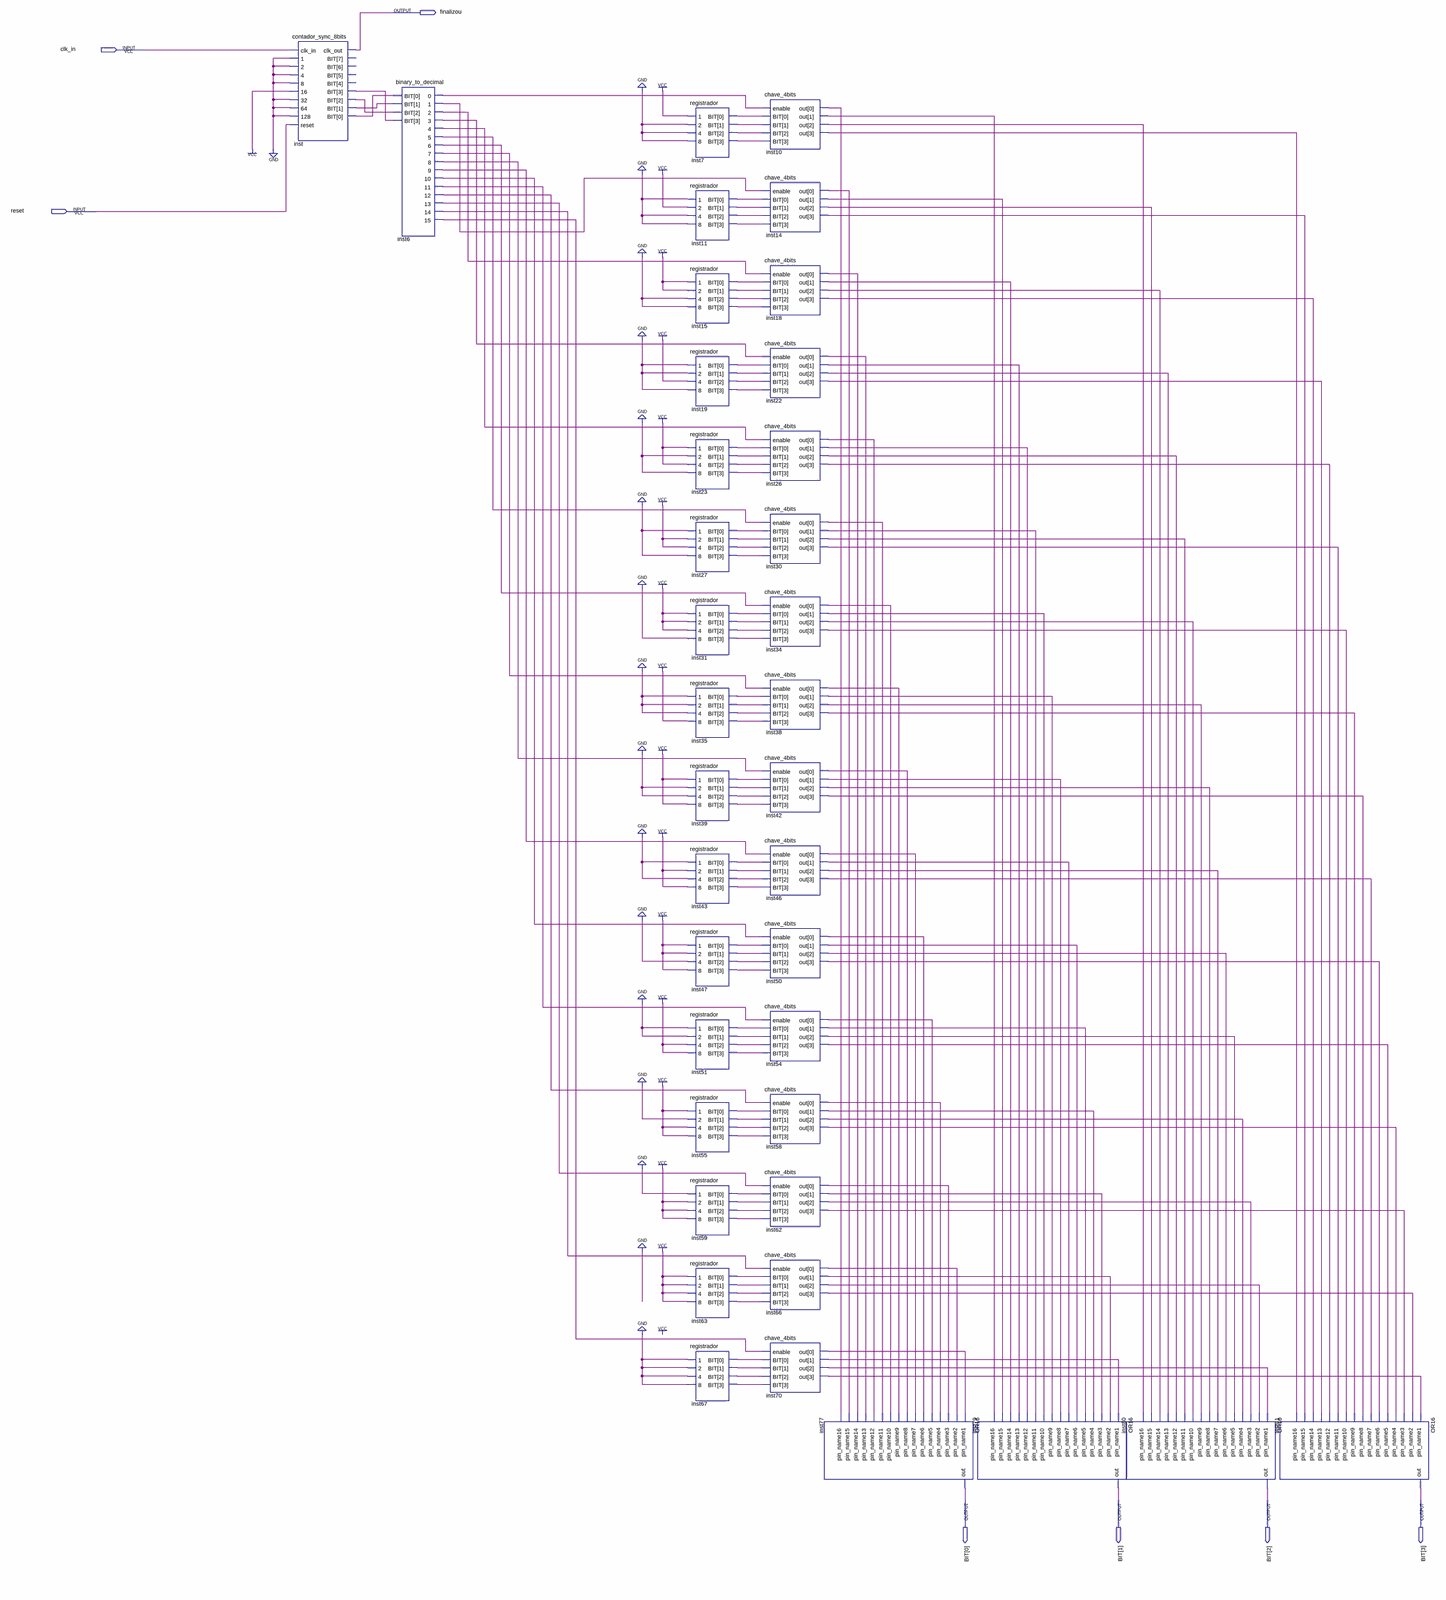
[diagram p0: schematic sheet, whole]
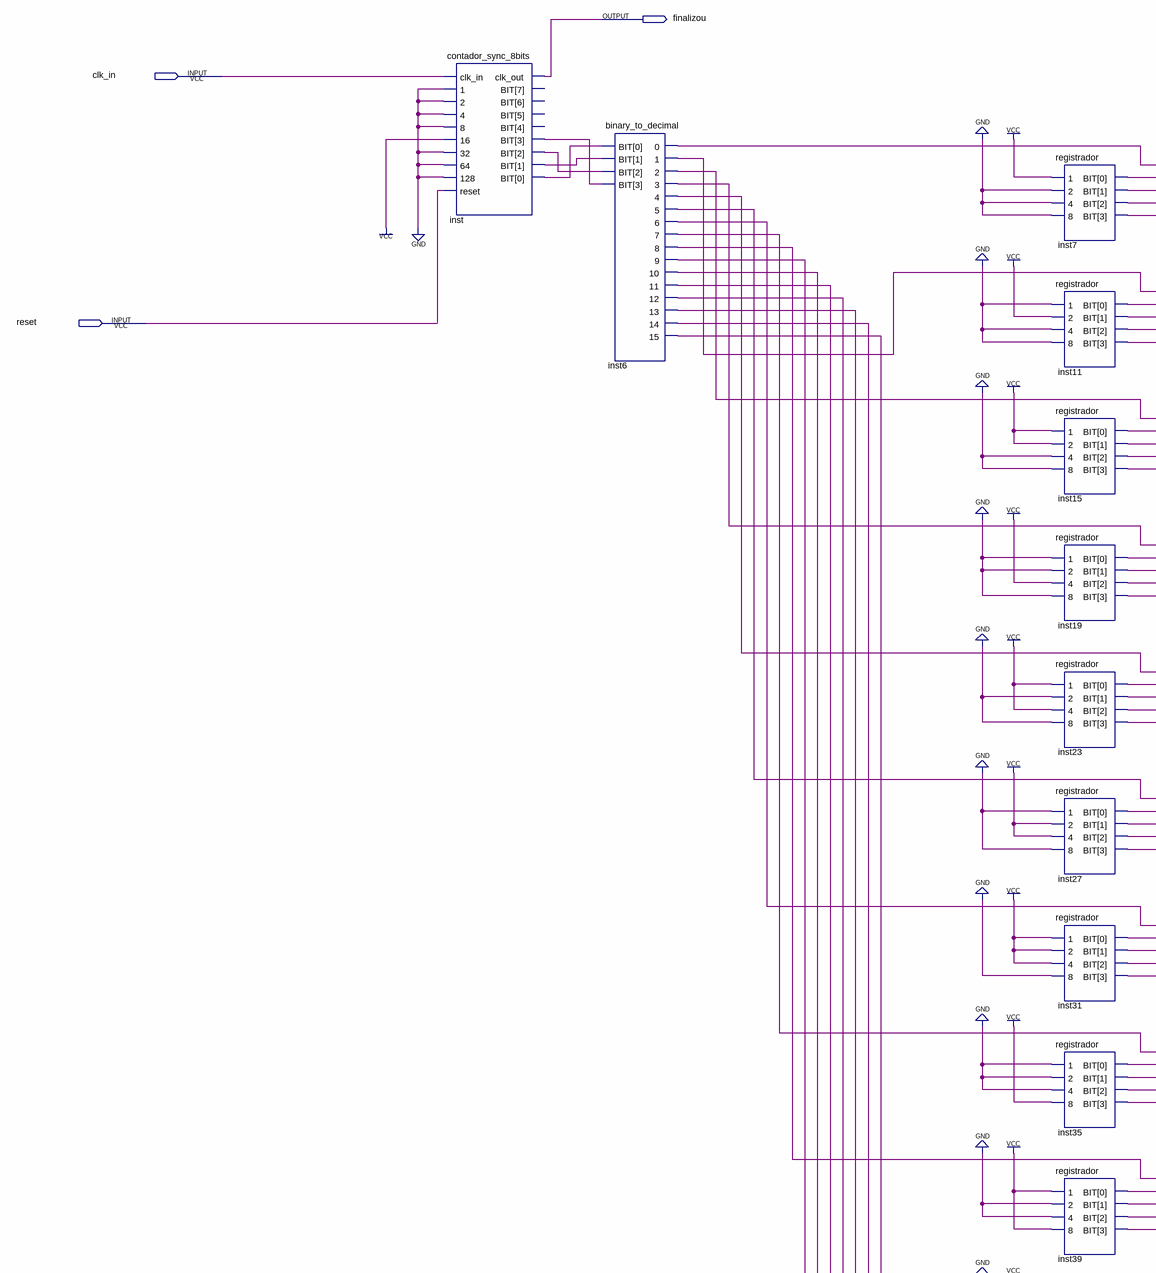
[diagram p1: schematic sheet, upper left part]
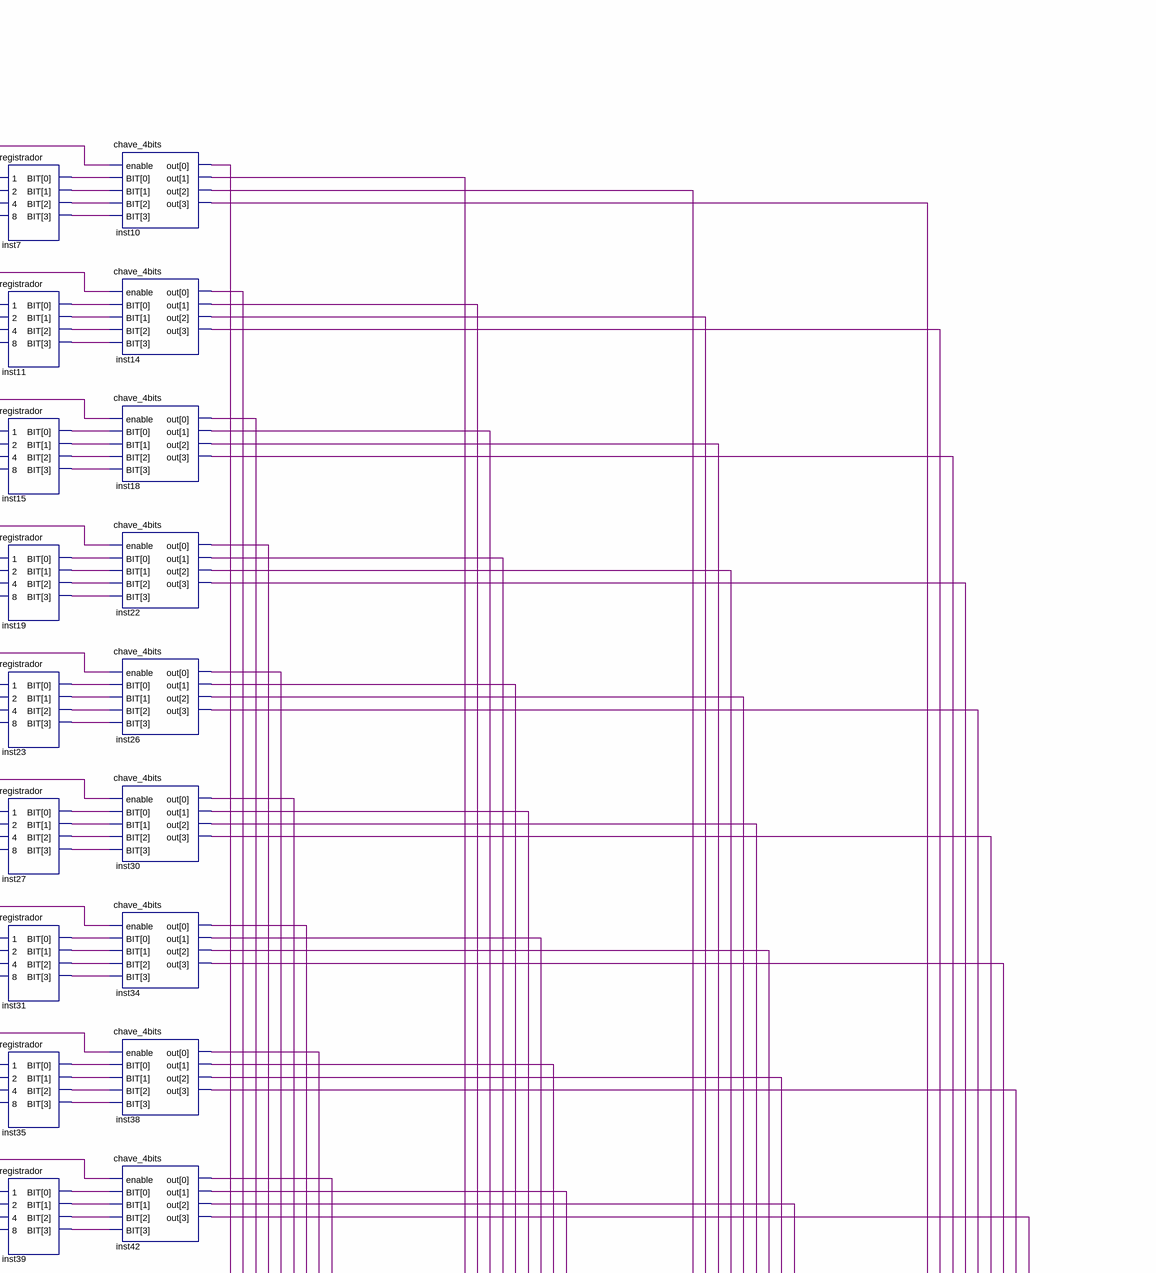
[diagram p2: schematic sheet, upper right part]
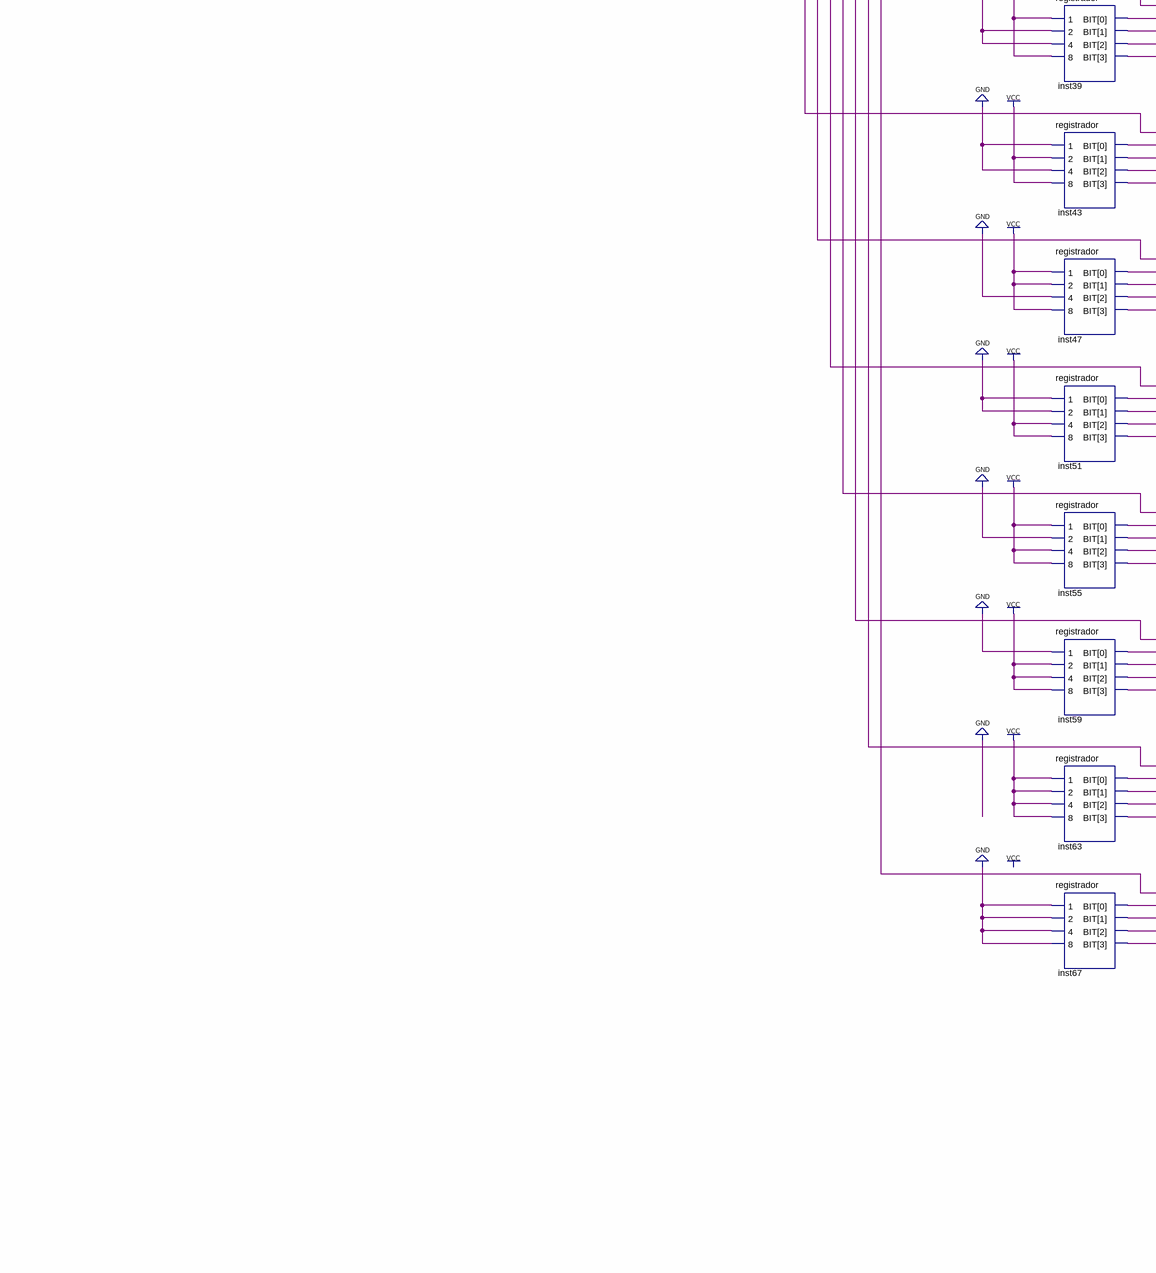
[diagram p3: schematic sheet, lower left part]
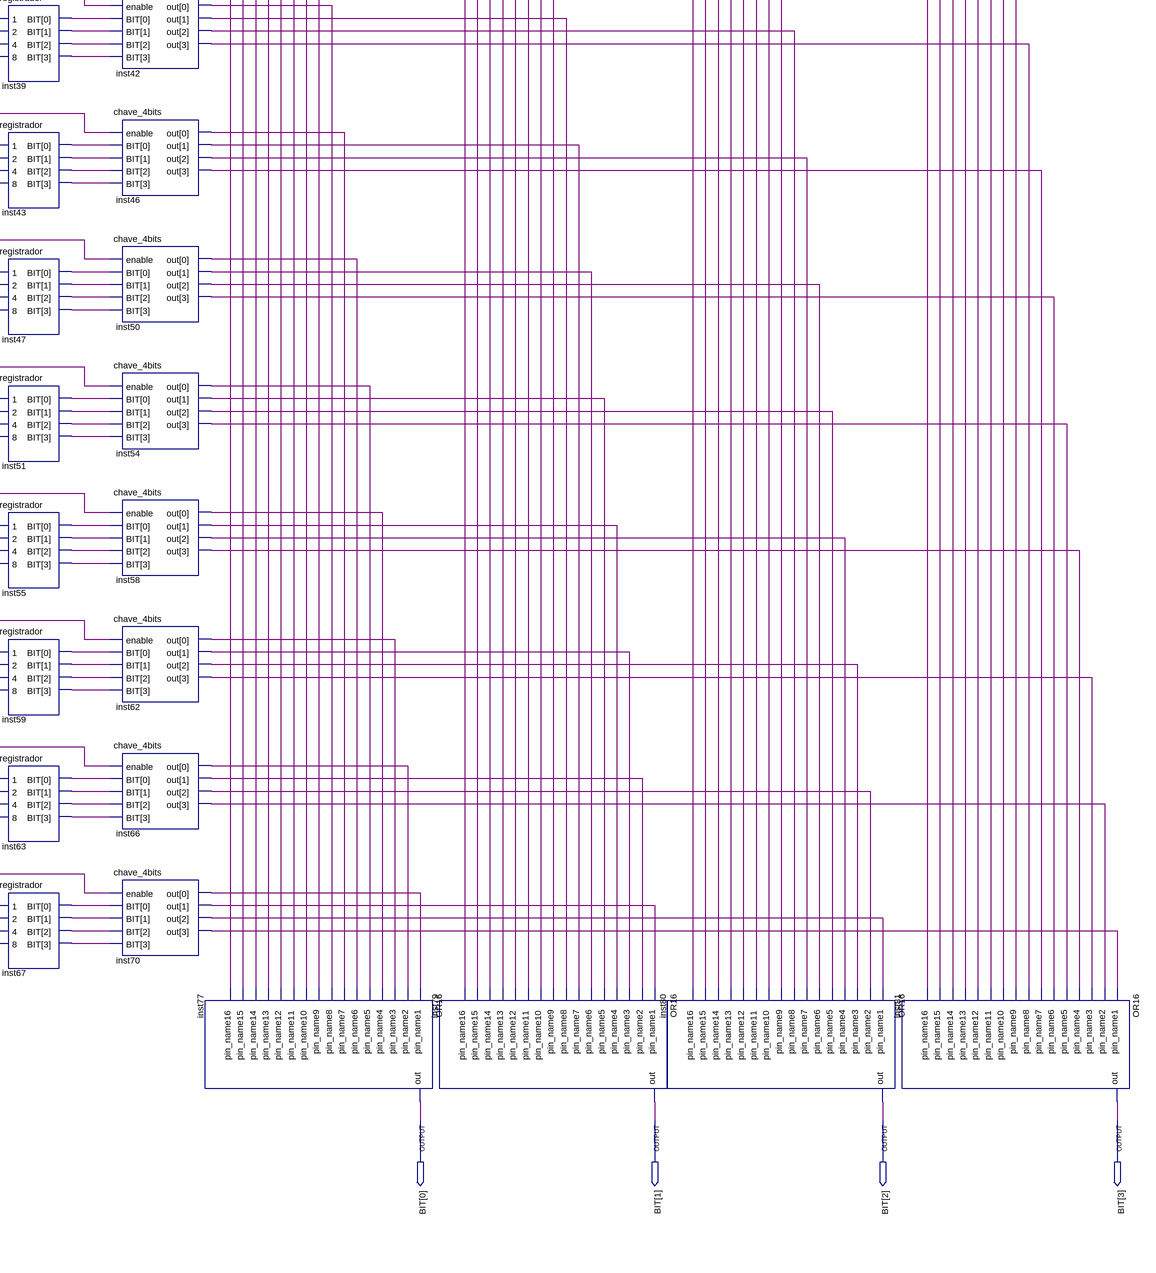
[diagram p4: schematic sheet, lower right part]
// Quartus schematic banco_de_registradores.bdf as structural Verilog: 38 symbols, 7 pins
module banco_de_registradores (
  input  clk_in,
  input  reset,
  output finalizou,
  output [3:0] BIT
);

  wire inst6_0, inst6_1, inst6_2, inst6_3, inst6_4, inst6_5, inst6_6, inst6_7, inst6_8, inst6_9, inst6_10,
       inst6_11, inst6_12, inst6_13, inst6_14, inst6_15, inst7_bit, inst7_bit_2, inst7_bit_3, inst7_bit_4,
       inst10_out, inst10_out_2, inst10_out_3, inst10_out_4, inst11_bit, inst11_bit_2, inst11_bit_3,
       inst11_bit_4, inst14_out, inst14_out_2, inst14_out_3, inst14_out_4, inst15_bit, inst15_bit_2,
       inst15_bit_3, inst15_bit_4, inst18_out, inst18_out_2, inst18_out_3, inst18_out_4, inst19_bit,
       inst19_bit_2, inst19_bit_3, inst19_bit_4, inst22_out, inst22_out_2, inst22_out_3, inst22_out_4,
       inst23_bit, inst23_bit_2, inst23_bit_3, inst23_bit_4, inst26_out, inst26_out_2, inst26_out_3,
       inst26_out_4, inst27_bit, inst27_bit_2, inst27_bit_3, inst27_bit_4, inst30_out, inst30_out_2,
       inst30_out_3, inst30_out_4, inst31_bit, inst31_bit_2, inst31_bit_3, inst31_bit_4, inst34_out,
       inst34_out_2, inst34_out_3, inst34_out_4, inst35_bit, inst35_bit_2, inst35_bit_3, inst35_bit_4,
       inst38_out, inst38_out_2, inst38_out_3, inst38_out_4, inst39_bit, inst39_bit_2, inst39_bit_3,
       inst39_bit_4, inst42_out, inst42_out_2, inst42_out_3, inst42_out_4, inst43_bit, inst43_bit_2,
       inst43_bit_3, inst43_bit_4, inst46_out, inst46_out_2, inst46_out_3, inst46_out_4, inst47_bit,
       inst47_bit_2, inst47_bit_3, inst47_bit_4, inst50_out, inst50_out_2, inst50_out_3, inst50_out_4,
       inst51_bit, inst51_bit_2, inst51_bit_3, inst51_bit_4, inst54_out, inst54_out_2, inst54_out_3,
       inst54_out_4, inst55_bit, inst55_bit_2, inst55_bit_3, inst55_bit_4, inst58_out, inst58_out_2,
       inst58_out_3, inst58_out_4, inst59_bit, inst59_bit_2, inst59_bit_3, inst59_bit_4, inst62_out,
       inst62_out_2, inst62_out_3, inst62_out_4, inst63_bit, inst63_bit_2, inst63_bit_3, inst63_bit_4,
       inst66_out, inst66_out_2, inst66_out_3, inst66_out_4, inst67_bit, inst67_bit_2, inst67_bit_3,
       inst67_bit_4, inst70_out, inst70_out_2, inst70_out_3, inst70_out_4, inst_bit, inst_bit_2, inst_bit_3,
       inst_bit_4;
  wire [7:0] inst_bit_open;  // unused outputs

  contador_sync_8bits inst (
    .clk_in(clk_in), .\1 (1'b0), .\2 (1'b0), .\4 (1'b0), .\8 (1'b0), .\16 (1'b1), .\32 (1'b0), .\64 (1'b0),
    .\128 (1'b0), .reset(reset), .clk_out(finalizou),
    .BIT({inst_bit_open[7:4], inst_bit_4, inst_bit_3, inst_bit_2, inst_bit}));
  binary_to_decimal inst6 (
    .BIT({inst_bit_4, inst_bit_3, inst_bit_2, inst_bit}), .\0 (inst6_0), .\1 (inst6_1), .\2 (inst6_2),
    .\3 (inst6_3), .\4 (inst6_4), .\5 (inst6_5), .\6 (inst6_6), .\7 (inst6_7), .\8 (inst6_8), .\9 (inst6_9),
    .\10 (inst6_10), .\11 (inst6_11), .\12 (inst6_12), .\13 (inst6_13), .\14 (inst6_14), .\15 (inst6_15));
  registrador inst7 (
    .\1 (1'b1), .\2 (1'b0), .\4 (1'b0), .\8 (1'b0), .BIT({inst7_bit_4, inst7_bit_3, inst7_bit_2, inst7_bit}));
  registrador inst11 (
    .\1 (1'b0), .\2 (1'b1), .\4 (1'b0), .\8 (1'b0),
    .BIT({inst11_bit_4, inst11_bit_3, inst11_bit_2, inst11_bit}));
  registrador inst15 (
    .\1 (1'b1), .\2 (1'b1), .\4 (1'b0), .\8 (1'b0),
    .BIT({inst15_bit_4, inst15_bit_3, inst15_bit_2, inst15_bit}));
  registrador inst19 (
    .\1 (1'b0), .\2 (1'b0), .\4 (1'b1), .\8 (1'b0),
    .BIT({inst19_bit_4, inst19_bit_3, inst19_bit_2, inst19_bit}));
  registrador inst23 (
    .\1 (1'b1), .\2 (1'b0), .\4 (1'b1), .\8 (1'b0),
    .BIT({inst23_bit_4, inst23_bit_3, inst23_bit_2, inst23_bit}));
  registrador inst27 (
    .\1 (1'b0), .\2 (1'b1), .\4 (1'b1), .\8 (1'b0),
    .BIT({inst27_bit_4, inst27_bit_3, inst27_bit_2, inst27_bit}));
  registrador inst31 (
    .\1 (1'b1), .\2 (1'b1), .\4 (1'b1), .\8 (1'b0),
    .BIT({inst31_bit_4, inst31_bit_3, inst31_bit_2, inst31_bit}));
  registrador inst35 (
    .\1 (1'b0), .\2 (1'b0), .\4 (1'b0), .\8 (1'b1),
    .BIT({inst35_bit_4, inst35_bit_3, inst35_bit_2, inst35_bit}));
  registrador inst39 (
    .\1 (1'b1), .\2 (1'b0), .\4 (1'b0), .\8 (1'b1),
    .BIT({inst39_bit_4, inst39_bit_3, inst39_bit_2, inst39_bit}));
  registrador inst43 (
    .\1 (1'b0), .\2 (1'b1), .\4 (1'b0), .\8 (1'b1),
    .BIT({inst43_bit_4, inst43_bit_3, inst43_bit_2, inst43_bit}));
  registrador inst47 (
    .\1 (1'b1), .\2 (1'b1), .\4 (1'b0), .\8 (1'b1),
    .BIT({inst47_bit_4, inst47_bit_3, inst47_bit_2, inst47_bit}));
  registrador inst51 (
    .\1 (1'b0), .\2 (1'b0), .\4 (1'b1), .\8 (1'b1),
    .BIT({inst51_bit_4, inst51_bit_3, inst51_bit_2, inst51_bit}));
  registrador inst55 (
    .\1 (1'b1), .\2 (1'b0), .\4 (1'b1), .\8 (1'b1),
    .BIT({inst55_bit_4, inst55_bit_3, inst55_bit_2, inst55_bit}));
  registrador inst59 (
    .\1 (1'b0), .\2 (1'b1), .\4 (1'b1), .\8 (1'b1),
    .BIT({inst59_bit_4, inst59_bit_3, inst59_bit_2, inst59_bit}));
  registrador inst63 (
    .\1 (1'b1), .\2 (1'b1), .\4 (1'b1), .\8 (1'b1),
    .BIT({inst63_bit_4, inst63_bit_3, inst63_bit_2, inst63_bit}));
  registrador inst67 (
    .\1 (1'b0), .\2 (1'b0), .\4 (1'b0), .\8 (1'b0),
    .BIT({inst67_bit_4, inst67_bit_3, inst67_bit_2, inst67_bit}));
  chave_4bits inst10 (
    .enable(inst6_0), .BIT({inst7_bit_4, inst7_bit_3, inst7_bit_2, inst7_bit}),
    .out({inst10_out_3, inst10_out_4, inst10_out_2, inst10_out}));
  chave_4bits inst14 (
    .enable(inst6_1), .BIT({inst11_bit_4, inst11_bit_3, inst11_bit_2, inst11_bit}),
    .out({inst14_out_3, inst14_out_4, inst14_out_2, inst14_out}));
  chave_4bits inst18 (
    .enable(inst6_2), .BIT({inst15_bit_4, inst15_bit_3, inst15_bit_2, inst15_bit}),
    .out({inst18_out_4, inst18_out_3, inst18_out_2, inst18_out}));
  chave_4bits inst22 (
    .enable(inst6_3), .BIT({inst19_bit_4, inst19_bit_3, inst19_bit_2, inst19_bit}),
    .out({inst22_out_4, inst22_out_3, inst22_out_2, inst22_out}));
  chave_4bits inst26 (
    .enable(inst6_4), .BIT({inst23_bit_4, inst23_bit_3, inst23_bit_2, inst23_bit}),
    .out({inst26_out_3, inst26_out_2, inst26_out_4, inst26_out}));
  chave_4bits inst30 (
    .enable(inst6_5), .BIT({inst27_bit_4, inst27_bit_3, inst27_bit_2, inst27_bit}),
    .out({inst30_out_4, inst30_out_3, inst30_out_2, inst30_out}));
  chave_4bits inst34 (
    .enable(inst6_6), .BIT({inst31_bit_4, inst31_bit_3, inst31_bit_2, inst31_bit}),
    .out({inst34_out_4, inst34_out_3, inst34_out_2, inst34_out}));
  chave_4bits inst38 (
    .enable(inst6_7), .BIT({inst35_bit_4, inst35_bit_3, inst35_bit_2, inst35_bit}),
    .out({inst38_out_4, inst38_out_3, inst38_out_2, inst38_out}));
  chave_4bits inst42 (
    .enable(inst6_8), .BIT({inst39_bit_4, inst39_bit_3, inst39_bit_2, inst39_bit}),
    .out({inst42_out_4, inst42_out_3, inst42_out_2, inst42_out}));
  chave_4bits inst46 (
    .enable(inst6_9), .BIT({inst43_bit_4, inst43_bit_3, inst43_bit_2, inst43_bit}),
    .out({inst46_out_4, inst46_out_3, inst46_out_2, inst46_out}));
  chave_4bits inst50 (
    .enable(inst6_10), .BIT({inst47_bit_4, inst47_bit_3, inst47_bit_2, inst47_bit}),
    .out({inst50_out_4, inst50_out_3, inst50_out_2, inst50_out}));
  chave_4bits inst54 (
    .enable(inst6_11), .BIT({inst51_bit_4, inst51_bit_3, inst51_bit_2, inst51_bit}),
    .out({inst54_out_4, inst54_out_3, inst54_out_2, inst54_out}));
  chave_4bits inst58 (
    .enable(inst6_12), .BIT({inst55_bit_4, inst55_bit_3, inst55_bit_2, inst55_bit}),
    .out({inst58_out_4, inst58_out_3, inst58_out_2, inst58_out}));
  chave_4bits inst62 (
    .enable(inst6_13), .BIT({inst59_bit_4, inst59_bit_3, inst59_bit_2, inst59_bit}),
    .out({inst62_out_3, inst62_out_2, inst62_out_4, inst62_out}));
  chave_4bits inst66 (
    .enable(inst6_14), .BIT({inst63_bit_4, inst63_bit_3, inst63_bit_2, inst63_bit}),
    .out({inst66_out_3, inst66_out_2, inst66_out_4, inst66_out}));
  chave_4bits inst70 (
    .enable(inst6_15), .BIT({inst67_bit_4, inst67_bit_3, inst67_bit_2, inst67_bit}),
    .out({inst70_out_3, inst70_out_2, inst70_out_4, inst70_out}));
  OR16 inst77 (
    .pin_name1(inst70_out), .pin_name2(inst66_out), .pin_name3(inst62_out), .pin_name4(inst58_out),
    .pin_name5(inst54_out), .pin_name6(inst50_out), .pin_name7(inst46_out), .pin_name8(inst42_out),
    .pin_name9(inst38_out), .pin_name10(inst34_out), .pin_name11(inst30_out), .pin_name12(inst26_out),
    .pin_name13(inst22_out), .pin_name14(inst18_out), .pin_name15(inst14_out), .pin_name16(inst10_out),
    .out(BIT[0]));
  OR16 inst79 (
    .pin_name1(inst70_out_4), .pin_name2(inst66_out_4), .pin_name3(inst62_out_4), .pin_name4(inst58_out_2),
    .pin_name5(inst54_out_2), .pin_name6(inst50_out_2), .pin_name7(inst46_out_2), .pin_name8(inst42_out_2),
    .pin_name9(inst38_out_2), .pin_name10(inst34_out_2), .pin_name11(inst30_out_2),
    .pin_name12(inst26_out_4), .pin_name13(inst22_out_2), .pin_name14(inst18_out_2),
    .pin_name15(inst14_out_2), .pin_name16(inst10_out_2), .out(BIT[1]));
  OR16 inst80 (
    .pin_name1(inst70_out_2), .pin_name2(inst66_out_2), .pin_name3(inst62_out_2), .pin_name4(inst58_out_3),
    .pin_name5(inst54_out_3), .pin_name6(inst50_out_3), .pin_name7(inst46_out_3), .pin_name8(inst42_out_3),
    .pin_name9(inst38_out_3), .pin_name10(inst34_out_3), .pin_name11(inst30_out_3),
    .pin_name12(inst26_out_2), .pin_name13(inst22_out_3), .pin_name14(inst18_out_3),
    .pin_name15(inst14_out_4), .pin_name16(inst10_out_4), .out(BIT[2]));
  OR16 inst81 (
    .pin_name1(inst70_out_3), .pin_name2(inst66_out_3), .pin_name3(inst62_out_3), .pin_name4(inst58_out_4),
    .pin_name5(inst54_out_4), .pin_name6(inst50_out_4), .pin_name7(inst46_out_4), .pin_name8(inst42_out_4),
    .pin_name9(inst38_out_4), .pin_name10(inst34_out_4), .pin_name11(inst30_out_4),
    .pin_name12(inst26_out_3), .pin_name13(inst22_out_4), .pin_name14(inst18_out_4),
    .pin_name15(inst14_out_3), .pin_name16(inst10_out_3), .out(BIT[3]));
endmodule
